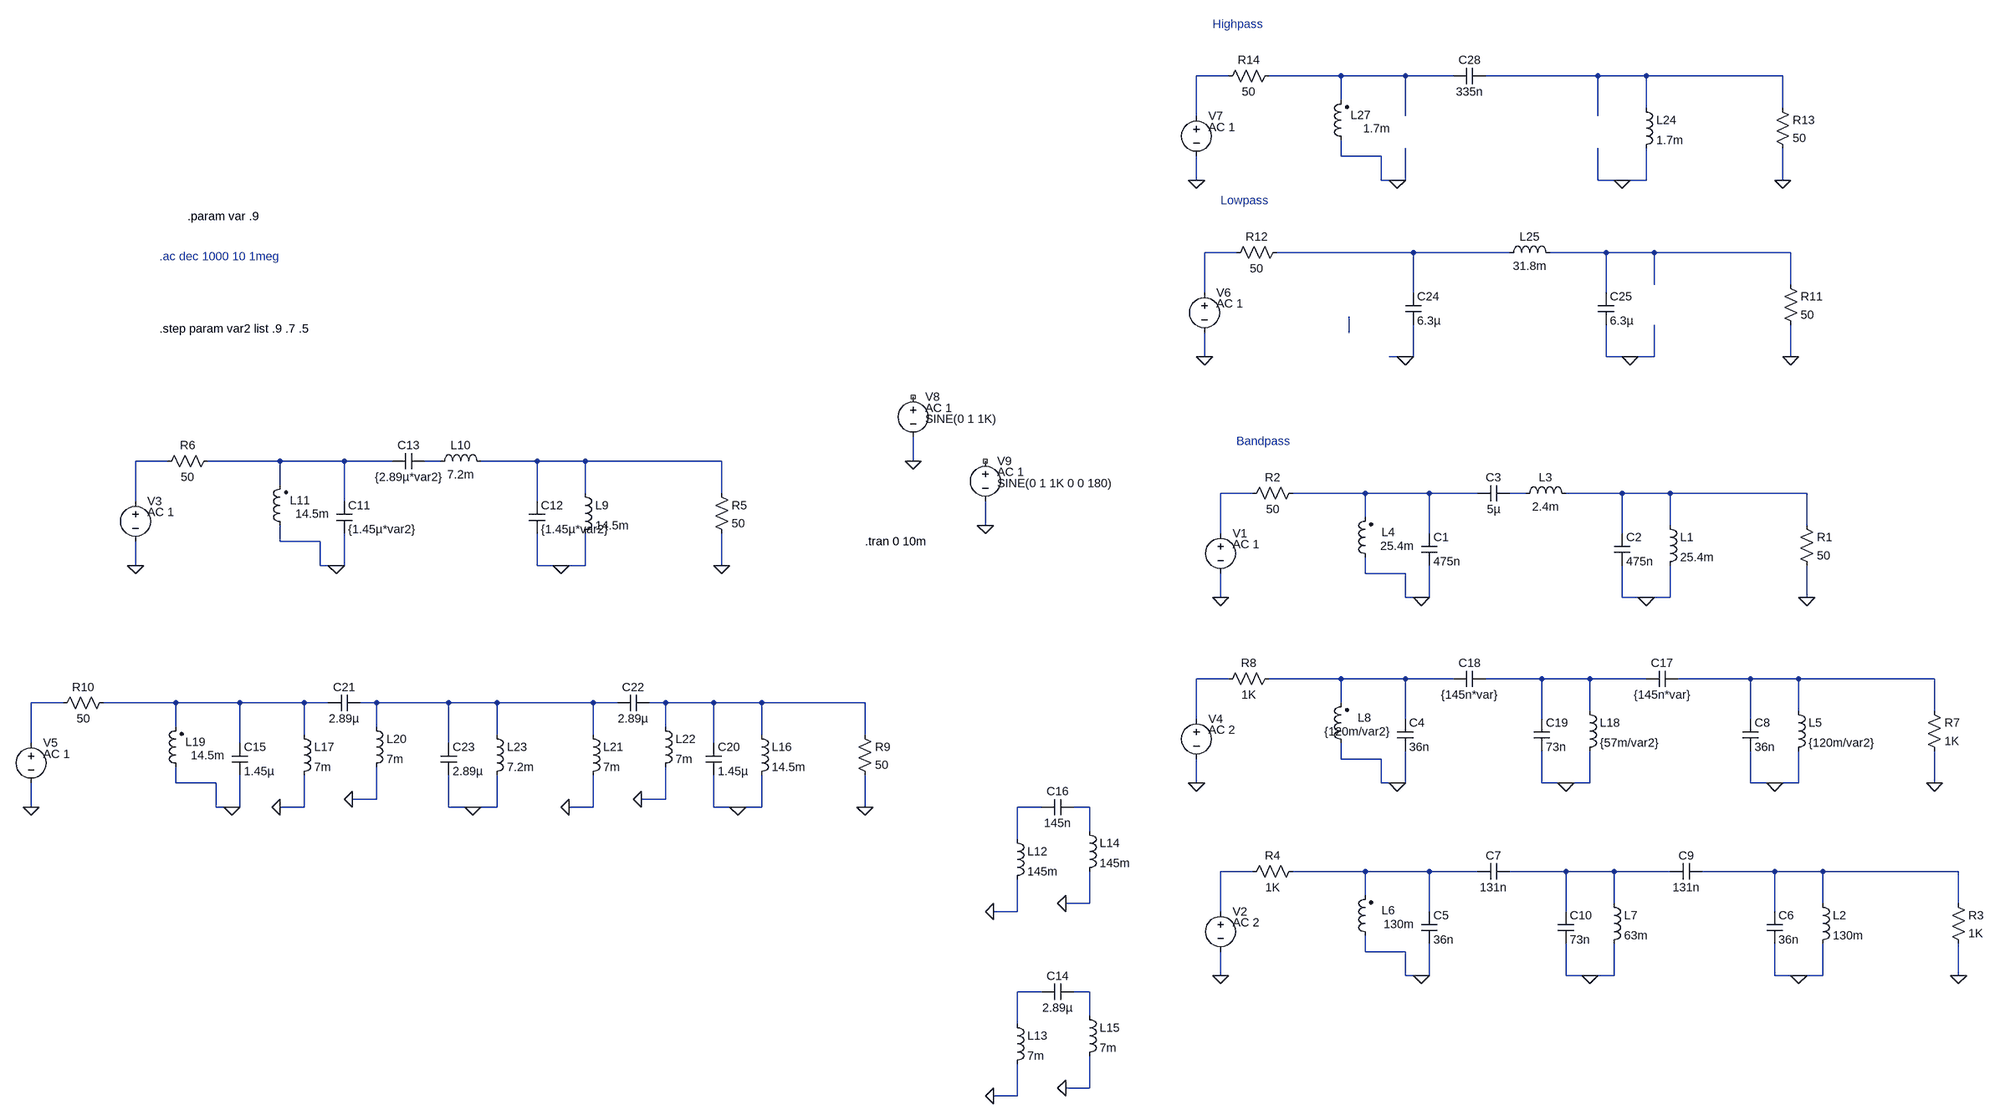
[diagram p0: schematic Reciver Filter2.asc]
Reciver Filter2.asc, the LTspice schematic file:
Version 4
SHEET 1 3428 1792
WIRE -576 -768 -640 -768
WIRE -352 -768 -496 -768
WIRE -224 -768 -352 -768
WIRE -128 -768 -224 -768
WIRE 160 -768 -64 -768
WIRE 256 -768 160 -768
WIRE 528 -768 256 -768
WIRE -352 -720 -352 -768
WIRE 256 -704 256 -768
WIRE 528 -704 528 -768
WIRE -640 -688 -640 -768
WIRE -224 -688 -224 -768
WIRE 160 -688 160 -768
WIRE -352 -608 -352 -640
WIRE -272 -608 -352 -608
WIRE -640 -560 -640 -608
WIRE -272 -560 -272 -608
WIRE -240 -560 -272 -560
WIRE -224 -560 -224 -624
WIRE -224 -560 -240 -560
WIRE 160 -560 160 -624
WIRE 208 -560 160 -560
WIRE 256 -560 256 -624
WIRE 256 -560 208 -560
WIRE 528 -560 528 -624
WIRE -560 -416 -624 -416
WIRE -208 -416 -480 -416
WIRE -16 -416 -208 -416
WIRE 176 -416 64 -416
WIRE 272 -416 176 -416
WIRE 544 -416 272 -416
WIRE 272 -352 272 -416
WIRE 544 -352 544 -416
WIRE -624 -336 -624 -416
WIRE -208 -336 -208 -416
WIRE 176 -336 176 -416
WIRE -336 -256 -336 -288
WIRE -624 -208 -624 -256
WIRE -224 -208 -256 -208
WIRE -208 -208 -208 -272
WIRE -208 -208 -224 -208
WIRE 176 -208 176 -272
WIRE 224 -208 176 -208
WIRE 272 -208 272 -272
WIRE 272 -208 224 -208
WIRE 544 -208 544 -272
WIRE -2800 0 -2864 0
WIRE -2576 0 -2720 0
WIRE -2448 0 -2576 0
WIRE -2352 0 -2448 0
WIRE -2256 0 -2288 0
WIRE -2064 0 -2176 0
WIRE -1968 0 -2064 0
WIRE -1696 0 -1968 0
WIRE -1248 0 -1248 -48
WIRE -2576 48 -2576 0
WIRE -1968 64 -1968 0
WIRE -1696 64 -1696 0
WIRE -528 64 -592 64
WIRE -304 64 -448 64
WIRE -176 64 -304 64
WIRE -80 64 -176 64
WIRE 16 64 -16 64
WIRE 208 64 96 64
WIRE 304 64 208 64
WIRE 576 64 304 64
WIRE -2864 80 -2864 0
WIRE -2448 80 -2448 0
WIRE -2064 80 -2064 0
WIRE -304 112 -304 64
WIRE -1104 128 -1104 80
WIRE 304 128 304 64
WIRE 576 128 576 64
WIRE -592 144 -592 64
WIRE -176 144 -176 64
WIRE 208 144 208 64
WIRE -2576 160 -2576 128
WIRE -2496 160 -2576 160
WIRE -2864 208 -2864 160
WIRE -2496 208 -2496 160
WIRE -2464 208 -2496 208
WIRE -2448 208 -2448 144
WIRE -2448 208 -2464 208
WIRE -2064 208 -2064 144
WIRE -2016 208 -2064 208
WIRE -1968 208 -1968 144
WIRE -1968 208 -2016 208
WIRE -1696 208 -1696 144
WIRE -304 224 -304 192
WIRE -224 224 -304 224
WIRE -592 272 -592 224
WIRE -224 272 -224 224
WIRE -192 272 -224 272
WIRE -176 272 -176 208
WIRE -176 272 -192 272
WIRE 208 272 208 208
WIRE 256 272 208 272
WIRE 304 272 304 208
WIRE 304 272 256 272
WIRE 576 272 576 208
WIRE -576 544 -640 544
WIRE -352 544 -496 544
WIRE -224 544 -352 544
WIRE -128 544 -224 544
WIRE 48 544 -64 544
WIRE 144 544 48 544
WIRE 256 544 144 544
WIRE 464 544 320 544
WIRE 560 544 464 544
WIRE 832 544 560 544
WIRE -3008 592 -3072 592
WIRE -2784 592 -2928 592
WIRE -2656 592 -2784 592
WIRE -2528 592 -2656 592
WIRE -2480 592 -2528 592
WIRE -2384 592 -2416 592
WIRE -2240 592 -2384 592
WIRE -2144 592 -2240 592
WIRE -1952 592 -2144 592
WIRE -1904 592 -1952 592
WIRE -1808 592 -1840 592
WIRE -1712 592 -1808 592
WIRE -1616 592 -1712 592
WIRE -1344 592 -1616 592
WIRE -352 592 -352 544
WIRE 144 608 144 544
WIRE 560 608 560 544
WIRE 832 608 832 544
WIRE -640 624 -640 544
WIRE -224 624 -224 544
WIRE 48 624 48 544
WIRE 464 624 464 544
WIRE -2784 640 -2784 592
WIRE -2384 640 -2384 592
WIRE -1808 640 -1808 592
WIRE -2528 656 -2528 592
WIRE -2144 656 -2144 592
WIRE -1952 656 -1952 592
WIRE -1616 656 -1616 592
WIRE -1344 656 -1344 592
WIRE -3072 672 -3072 592
WIRE -2656 672 -2656 592
WIRE -2240 672 -2240 592
WIRE -1712 672 -1712 592
WIRE -352 704 -352 672
WIRE -272 704 -352 704
WIRE -2784 752 -2784 720
WIRE -2704 752 -2784 752
WIRE -640 752 -640 704
WIRE -272 752 -272 704
WIRE -240 752 -272 752
WIRE -224 752 -224 688
WIRE -224 752 -240 752
WIRE 48 752 48 688
WIRE 96 752 48 752
WIRE 144 752 144 688
WIRE 144 752 96 752
WIRE 464 752 464 688
WIRE 512 752 464 752
WIRE 560 752 560 688
WIRE 560 752 512 752
WIRE 832 752 832 688
WIRE -2384 784 -2384 720
WIRE -2384 784 -2432 784
WIRE -1808 784 -1808 720
WIRE -1808 784 -1856 784
WIRE -3072 800 -3072 752
WIRE -2704 800 -2704 752
WIRE -2672 800 -2704 800
WIRE -2656 800 -2656 736
WIRE -2656 800 -2672 800
WIRE -2528 800 -2528 736
WIRE -2528 800 -2576 800
WIRE -2240 800 -2240 736
WIRE -2192 800 -2240 800
WIRE -2144 800 -2144 736
WIRE -2144 800 -2192 800
WIRE -1952 800 -1952 736
WIRE -1952 800 -2000 800
WIRE -1712 800 -1712 736
WIRE -1664 800 -1712 800
WIRE -1616 800 -1616 736
WIRE -1616 800 -1664 800
WIRE -1344 800 -1344 736
WIRE -992 800 -1040 800
WIRE -896 800 -928 800
WIRE -896 848 -896 800
WIRE -1040 864 -1040 800
WIRE -528 928 -592 928
WIRE -304 928 -448 928
WIRE -176 928 -304 928
WIRE -80 928 -176 928
WIRE 96 928 -16 928
WIRE 192 928 96 928
WIRE 304 928 192 928
WIRE 512 928 368 928
WIRE 608 928 512 928
WIRE 880 928 608 928
WIRE -304 976 -304 928
WIRE -896 992 -896 928
WIRE -896 992 -944 992
WIRE 192 992 192 928
WIRE 608 992 608 928
WIRE 880 992 880 928
WIRE -1040 1008 -1040 944
WIRE -1040 1008 -1088 1008
WIRE -592 1008 -592 928
WIRE -176 1008 -176 928
WIRE 96 1008 96 928
WIRE 512 1008 512 928
WIRE -304 1088 -304 1056
WIRE -224 1088 -304 1088
WIRE -592 1136 -592 1088
WIRE -224 1136 -224 1088
WIRE -192 1136 -224 1136
WIRE -176 1136 -176 1072
WIRE -176 1136 -192 1136
WIRE 96 1136 96 1072
WIRE 144 1136 96 1136
WIRE 192 1136 192 1072
WIRE 192 1136 144 1136
WIRE 512 1136 512 1072
WIRE 560 1136 512 1136
WIRE 608 1136 608 1072
WIRE 608 1136 560 1136
WIRE 880 1136 880 1072
WIRE -992 1168 -1040 1168
WIRE -896 1168 -928 1168
WIRE -896 1216 -896 1168
WIRE -1040 1232 -1040 1168
WIRE -896 1360 -896 1296
WIRE -896 1360 -944 1360
WIRE -1040 1376 -1040 1312
WIRE -1040 1376 -1088 1376
FLAG 256 272 0
FLAG -192 272 0
FLAG -592 272 0
FLAG 576 272 0
FLAG 512 752 0
FLAG -240 752 0
FLAG -640 752 0
FLAG 832 752 0
FLAG -1088 1008 0
FLAG -944 992 0
FLAG 96 752 0
FLAG 560 1136 0
FLAG -192 1136 0
FLAG -592 1136 0
FLAG 880 1136 0
FLAG 144 1136 0
FLAG -2016 208 0
FLAG -2464 208 0
FLAG -2864 208 0
FLAG -1696 208 0
FLAG -1088 1376 0
FLAG -944 1360 0
FLAG -1664 800 0
FLAG -2672 800 0
FLAG -3072 800 0
FLAG -1344 800 0
FLAG -2576 800 0
FLAG -2432 784 0
FLAG -2000 800 0
FLAG -1856 784 0
FLAG -2192 800 0
FLAG 224 -208 0
FLAG -224 -208 0
FLAG -624 -208 0
FLAG 544 -208 0
FLAG 208 -560 0
FLAG -240 -560 0
FLAG -640 -560 0
FLAG 528 -560 0
FLAG -1248 0 0
FLAG -1104 128 0
SYMBOL cap -192 144 R0
SYMATTR InstName C1
SYMATTR Value 475n
SYMBOL cap 192 144 R0
SYMATTR InstName C2
SYMATTR Value 475n
SYMBOL cap -16 48 R90
WINDOW 0 0 32 VBottom 2
WINDOW 3 32 32 VTop 2
SYMATTR InstName C3
SYMATTR Value 5µ
SYMBOL ind 288 112 R0
SYMATTR InstName L1
SYMATTR Value 25.4m
SYMBOL res 560 112 R0
SYMATTR InstName R1
SYMATTR Value 50
SYMBOL res -432 48 R90
WINDOW 0 0 56 VBottom 2
WINDOW 3 32 56 VTop 2
SYMATTR InstName R2
SYMATTR Value 50
SYMBOL voltage -592 128 R0
WINDOW 123 24 38 Left 2
SYMATTR Value2 AC 1
SYMATTR InstName V1
SYMATTR Value ""
SYMBOL ind 0 80 R270
WINDOW 0 32 56 VTop 2
WINDOW 3 5 56 VBottom 2
SYMATTR InstName L3
SYMATTR Value 2.4m
SYMBOL ind2 -288 208 R180
WINDOW 0 -44 66 Left 2
WINDOW 3 -82 39 Left 2
SYMATTR InstName L4
SYMATTR Value 25.4m
SYMBOL cap -240 624 R0
SYMATTR InstName C4
SYMATTR Value 36n
SYMBOL cap 448 624 R0
SYMATTR InstName C8
SYMATTR Value 36n
SYMBOL ind 544 592 R0
SYMATTR InstName L5
SYMATTR Value {120m/var2}
SYMBOL res 816 592 R0
SYMATTR InstName R7
SYMATTR Value 1K
SYMBOL res -480 528 R90
WINDOW 0 0 56 VBottom 2
WINDOW 3 32 56 VTop 2
SYMATTR InstName R8
SYMATTR Value 1K
SYMBOL voltage -640 608 R0
WINDOW 123 24 38 Left 2
SYMATTR Value2 AC 2
SYMATTR InstName V4
SYMATTR Value ""
SYMBOL ind2 -336 688 R180
WINDOW 0 -44 66 Left 2
WINDOW 3 -82 39 Left 2
SYMATTR InstName L8
SYMATTR Value {120m/var2}
SYMBOL ind -1056 848 R0
SYMATTR InstName L12
SYMATTR Value 145m
SYMBOL cap -928 784 R90
WINDOW 0 0 32 VBottom 2
WINDOW 3 32 32 VTop 2
SYMATTR InstName C16
SYMATTR Value 145n
SYMBOL ind -912 832 R0
SYMATTR InstName L14
SYMATTR Value 145m
SYMBOL cap -64 528 R90
WINDOW 0 0 32 VBottom 2
WINDOW 3 32 32 VTop 2
SYMATTR InstName C18
SYMATTR Value {145n*var}
SYMBOL cap 320 528 R90
WINDOW 0 0 32 VBottom 2
WINDOW 3 32 32 VTop 2
SYMATTR InstName C17
SYMATTR Value {145n*var}
SYMBOL cap 32 624 R0
SYMATTR InstName C19
SYMATTR Value 73n
SYMBOL ind 128 592 R0
SYMATTR InstName L18
SYMATTR Value {57m/var2}
SYMBOL cap -192 1008 R0
SYMATTR InstName C5
SYMATTR Value 36n
SYMBOL cap 496 1008 R0
SYMATTR InstName C6
SYMATTR Value 36n
SYMBOL ind 592 976 R0
SYMATTR InstName L2
SYMATTR Value 130m
SYMBOL res 864 976 R0
SYMATTR InstName R3
SYMATTR Value 1K
SYMBOL res -432 912 R90
WINDOW 0 0 56 VBottom 2
WINDOW 3 32 56 VTop 2
SYMATTR InstName R4
SYMATTR Value 1K
SYMBOL voltage -592 992 R0
WINDOW 123 24 38 Left 2
SYMATTR Value2 AC 2
SYMATTR InstName V2
SYMATTR Value ""
SYMBOL ind2 -288 1072 R180
WINDOW 0 -44 66 Left 2
WINDOW 3 -82 39 Left 2
SYMATTR InstName L6
SYMATTR Value 130m
SYMBOL cap -16 912 R90
WINDOW 0 0 32 VBottom 2
WINDOW 3 32 32 VTop 2
SYMATTR InstName C7
SYMATTR Value 131n
SYMBOL cap 368 912 R90
WINDOW 0 0 32 VBottom 2
WINDOW 3 32 32 VTop 2
SYMATTR InstName C9
SYMATTR Value 131n
SYMBOL cap 80 1008 R0
SYMATTR InstName C10
SYMATTR Value 73n
SYMBOL ind 176 976 R0
SYMATTR InstName L7
SYMATTR Value 63m
SYMBOL cap -2464 80 R0
SYMATTR InstName C11
SYMATTR Value {1.45µ*var2}
SYMBOL cap -2080 80 R0
SYMATTR InstName C12
SYMATTR Value {1.45µ*var2}
SYMBOL cap -2288 -16 R90
WINDOW 0 0 32 VBottom 2
WINDOW 3 32 32 VTop 2
SYMATTR InstName C13
SYMATTR Value {2.89µ*var2}
SYMBOL ind -1984 48 R0
SYMATTR InstName L9
SYMATTR Value 14.5m
SYMBOL res -1712 48 R0
SYMATTR InstName R5
SYMATTR Value 50
SYMBOL res -2704 -16 R90
WINDOW 0 0 56 VBottom 2
WINDOW 3 32 56 VTop 2
SYMATTR InstName R6
SYMATTR Value 50
SYMBOL voltage -2864 64 R0
WINDOW 123 24 38 Left 2
SYMATTR Value2 AC 1
SYMATTR InstName V3
SYMATTR Value ""
SYMBOL ind -2272 16 R270
WINDOW 0 32 56 VTop 2
WINDOW 3 5 56 VBottom 2
SYMATTR InstName L10
SYMATTR Value 7.2m
SYMBOL ind2 -2560 144 R180
WINDOW 0 -44 66 Left 2
WINDOW 3 -82 39 Left 2
SYMATTR InstName L11
SYMATTR Value 14.5m
SYMBOL ind -1056 1216 R0
SYMATTR InstName L13
SYMATTR Value 7m
SYMBOL cap -928 1152 R90
WINDOW 0 0 32 VBottom 2
WINDOW 3 32 32 VTop 2
SYMATTR InstName C14
SYMATTR Value 2.89µ
SYMBOL ind -912 1200 R0
SYMATTR InstName L15
SYMATTR Value 7m
SYMBOL cap -2672 672 R0
SYMATTR InstName C15
SYMATTR Value 1.45µ
SYMBOL cap -1728 672 R0
SYMATTR InstName C20
SYMATTR Value 1.45µ
SYMBOL ind -1632 640 R0
SYMATTR InstName L16
SYMATTR Value 14.5m
SYMBOL res -1360 640 R0
SYMATTR InstName R9
SYMATTR Value 50
SYMBOL res -2912 576 R90
WINDOW 0 0 56 VBottom 2
WINDOW 3 32 56 VTop 2
SYMATTR InstName R10
SYMATTR Value 50
SYMBOL voltage -3072 656 R0
WINDOW 123 24 38 Left 2
SYMATTR Value2 AC 1
SYMATTR InstName V5
SYMATTR Value ""
SYMBOL ind2 -2768 736 R180
WINDOW 0 -44 66 Left 2
WINDOW 3 -82 39 Left 2
SYMATTR InstName L19
SYMATTR Value 14.5m
SYMBOL ind -2544 640 R0
SYMATTR InstName L17
SYMATTR Value 7m
SYMBOL cap -2416 576 R90
WINDOW 0 0 32 VBottom 2
WINDOW 3 32 32 VTop 2
SYMATTR InstName C21
SYMATTR Value 2.89µ
SYMBOL ind -2400 624 R0
SYMATTR InstName L20
SYMATTR Value 7m
SYMBOL ind -1968 640 R0
SYMATTR InstName L21
SYMATTR Value 7m
SYMBOL cap -1840 576 R90
WINDOW 0 0 32 VBottom 2
WINDOW 3 32 32 VTop 2
SYMATTR InstName C22
SYMATTR Value 2.89µ
SYMBOL ind -1824 624 R0
SYMATTR InstName L22
SYMATTR Value 7m
SYMBOL cap -2256 672 R0
SYMATTR InstName C23
SYMATTR Value 2.89µ
SYMBOL ind -2160 640 R0
SYMATTR InstName L23
SYMATTR Value 7.2m
SYMBOL cap -224 -336 R0
SYMATTR InstName C24
SYMATTR Value 6.3µ
SYMBOL cap 160 -336 R0
SYMATTR InstName C25
SYMATTR Value 6.3µ
SYMBOL res 528 -368 R0
SYMATTR InstName R11
SYMATTR Value 50
SYMBOL res -464 -432 R90
WINDOW 0 0 56 VBottom 2
WINDOW 3 32 56 VTop 2
SYMATTR InstName R12
SYMATTR Value 50
SYMBOL voltage -624 -352 R0
WINDOW 123 24 38 Left 2
SYMATTR Value2 AC 1
SYMATTR InstName V6
SYMATTR Value ""
SYMBOL ind -32 -400 R270
WINDOW 0 32 56 VTop 2
WINDOW 3 5 56 VBottom 2
SYMATTR InstName L25
SYMATTR Value 31.8m
SYMBOL cap -64 -784 R90
WINDOW 0 0 32 VBottom 2
WINDOW 3 32 32 VTop 2
SYMATTR InstName C28
SYMATTR Value 335n
SYMBOL ind 240 -720 R0
SYMATTR InstName L24
SYMATTR Value 1.7m
SYMBOL res 512 -720 R0
SYMATTR InstName R13
SYMATTR Value 50
SYMBOL res -480 -784 R90
WINDOW 0 0 56 VBottom 2
WINDOW 3 32 56 VTop 2
SYMATTR InstName R14
SYMATTR Value 50
SYMBOL voltage -640 -704 R0
WINDOW 123 24 38 Left 2
SYMATTR Value2 AC 1
SYMATTR InstName V7
SYMATTR Value ""
SYMBOL ind2 -336 -624 R180
WINDOW 0 -44 66 Left 2
WINDOW 3 -82 39 Left 2
SYMATTR InstName L27
SYMATTR Value 1.7m
SYMBOL voltage -1248 -144 R0
WINDOW 123 24 38 Left 2
WINDOW 3 24 60 Left 2
SYMATTR Value2 AC 1
SYMATTR InstName V8
SYMATTR Value SINE(0 1 1K)
SYMBOL voltage -1104 -16 R0
WINDOW 123 24 38 Left 2
WINDOW 3 24 60 Left 2
SYMATTR Value2 AC 1
SYMATTR InstName V9
SYMATTR Value SINE(0 1 1K 0 0 180)
TEXT -2816 -408 Left 2 ;.ac dec 1000 10 1meg
TEXT -2760 -488 Left 2 !.param var .9
TEXT -2816 -264 Left 2 !.step param var2 list .9 .7 .5
TEXT -560 -40 Left 2 ;Bandpass
TEXT -592 -520 Left 2 ;Lowpass
TEXT -608 -872 Left 2 ;Highpass
TEXT -1344 160 Left 2 !.tran 0 10m

The netlist it stands for:
* Reciver Filter2.asc
C1 N013 0 475n
C2 N015 0 475n
C3 N014 N013 5µ
L1 N015 0 25.4m
R1 N015 0 50
R2 N013 N012 50
V1 N012 0 AC 1
L3 N014 N015 2.4m
L4 0 N013 25.4m
C4 N017 0 36n
C8 N019 0 36n
L5 N019 0 {120m/var2}
R7 N019 0 1K
R8 N017 N016 1K
V4 N016 0 AC 2
L8 0 N017 {120m/var2}
L12 N024 0 145m
C16 N025 N024 145n
L14 N025 0 145m
C18 N018 N017 {145n*var}
C17 N019 N018 {145n*var}
C19 N018 0 73n
L18 N018 0 {57m/var2}
C5 N027 0 36n
C6 N029 0 36n
L2 N029 0 130m
R3 N029 0 1K
R4 N027 N026 1K
V2 N026 0 AC 2
L6 0 N027 130m
C7 N028 N027 131n
C9 N029 N028 131n
C10 N028 0 73n
L7 N028 0 63m
C11 N009 0 {1.45µ*var2}
C12 N011 0 {1.45µ*var2}
C13 N010 N009 {2.89µ*var2}
L9 N011 0 14.5m
R5 N011 0 50
R6 N009 N008 50
V3 N008 0 AC 1
L10 N010 N011 7.2m
L11 0 N009 14.5m
L13 N030 0 7m
C14 N031 N030 2.89µ
L15 N031 0 7m
C15 N021 0 1.45µ
C20 N023 0 1.45µ
L16 N023 0 14.5m
R9 N023 0 50
R10 N021 N020 50
V5 N020 0 AC 1
L19 0 N021 14.5m
L17 N021 0 7m
C21 N022 N021 2.89µ
L20 N022 0 7m
L21 N022 0 7m
C22 N023 N022 2.89µ
L22 N023 0 7m
C23 N022 0 2.89µ
L23 N022 0 7.2m
C24 N005 0 6.3µ
C25 N006 0 6.3µ
R11 N006 0 50
R12 N005 N004 50
V6 N004 0 AC 1
L25 N005 N006 31.8m
C28 N003 N002 335n
L24 N003 0 1.7m
R13 N003 0 50
R14 N002 N001 50
V7 N001 0 AC 1
L27 0 N002 1.7m
V8 NC_01 0 SINE(0 1 1K) AC 1
V9 NC_02 0 SINE(0 1 1K 0 0 180) AC 1
* .ac dec 1000 10 1meg
.param var .9
.step param var2 list .9 .7 .5
* Bandpass
* Lowpass
* Highpass
.tran 0 10m
.backanno
.end